# EAGLE design M891 (EAGLE 6.6.0)
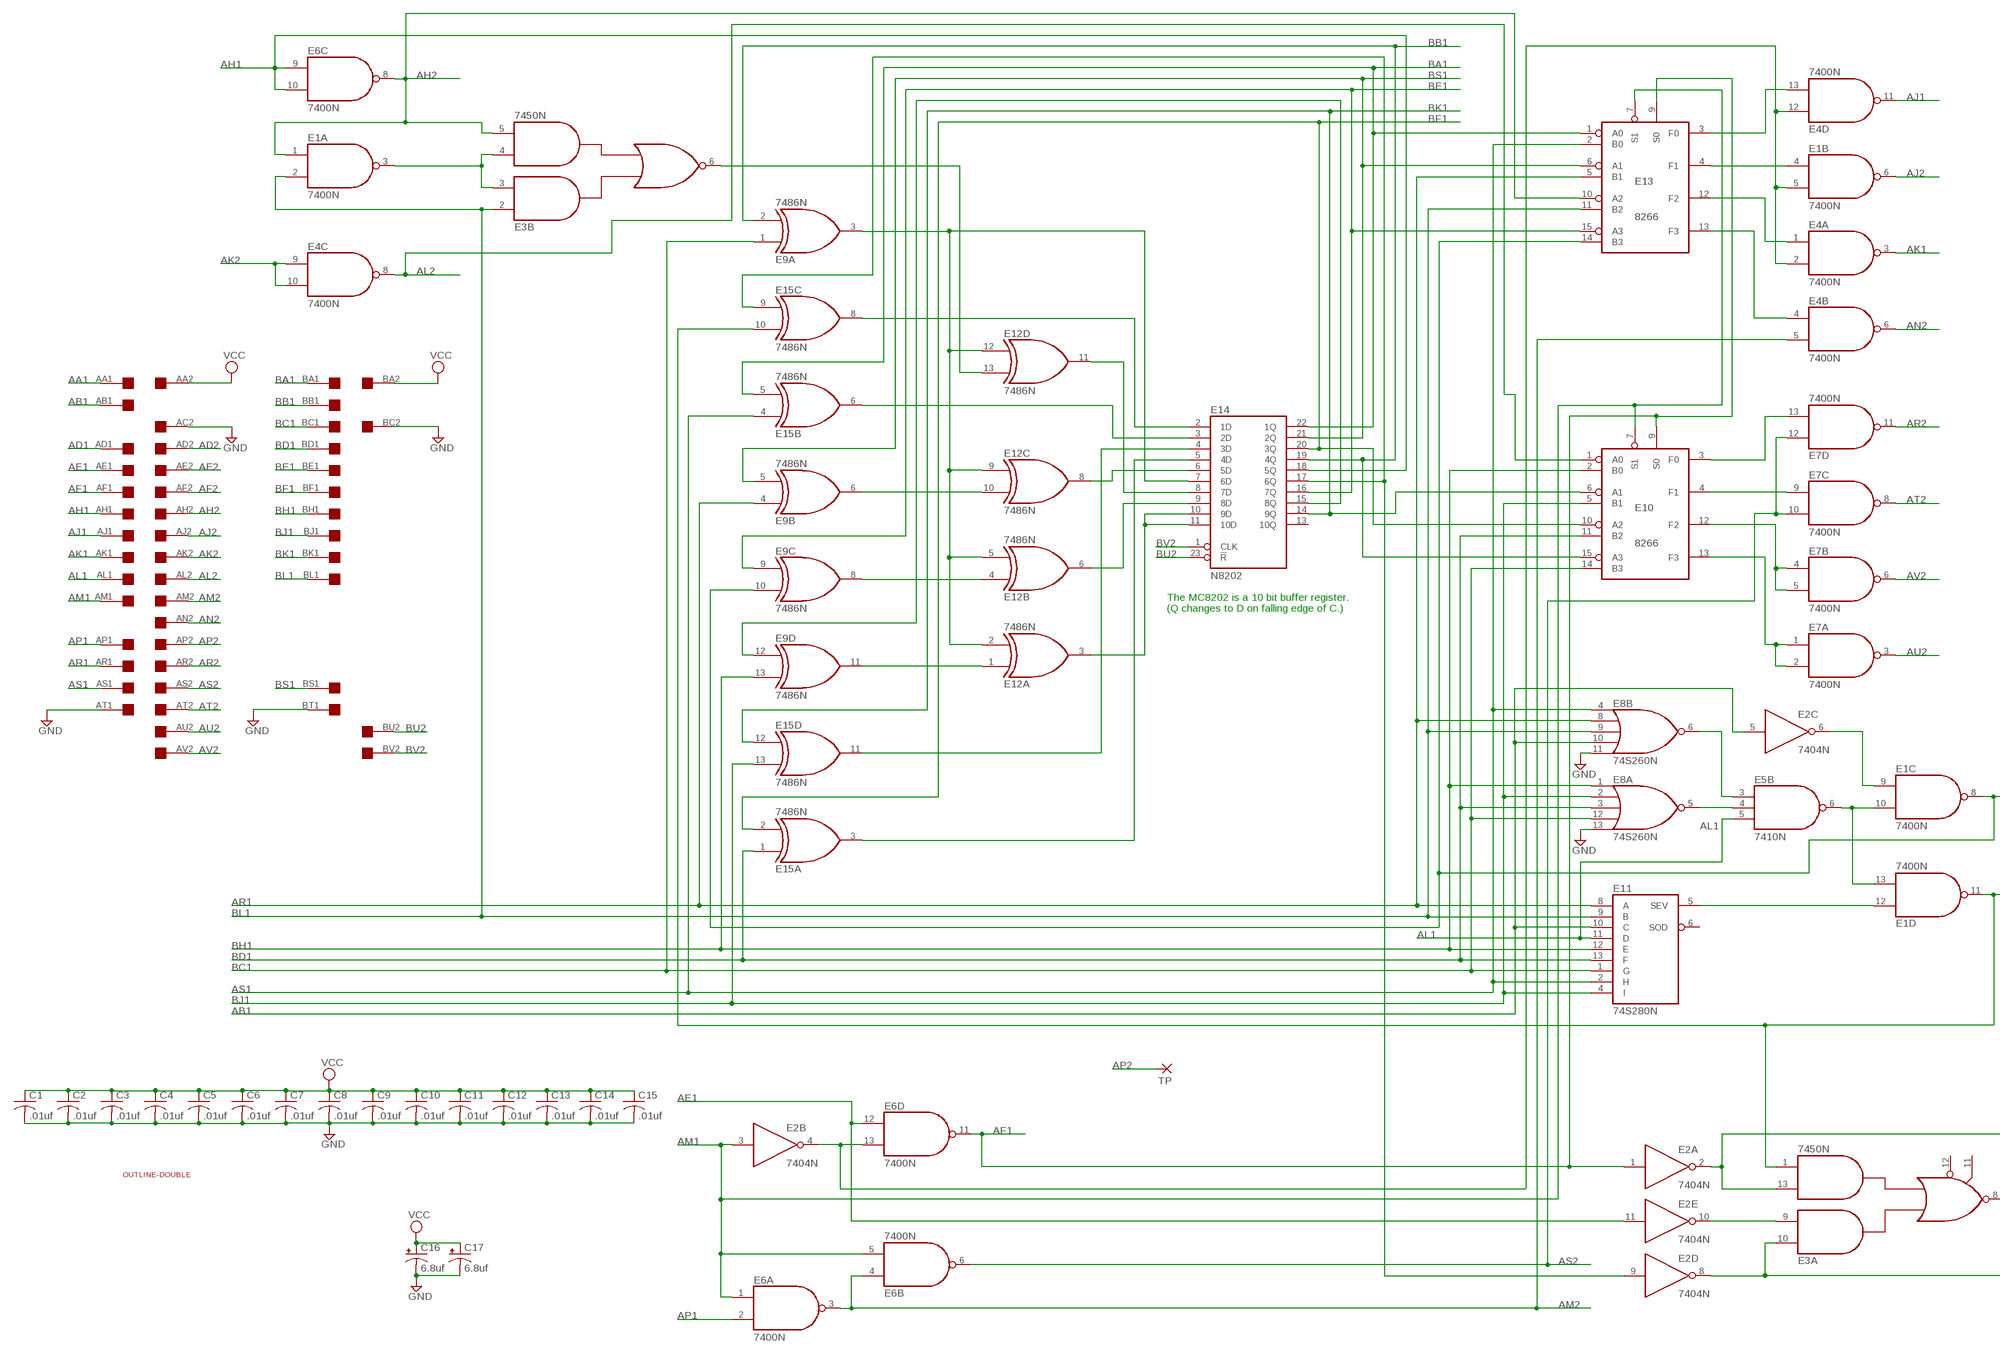
[diagram p0: schematic, sheet 1, part 1 of 2]
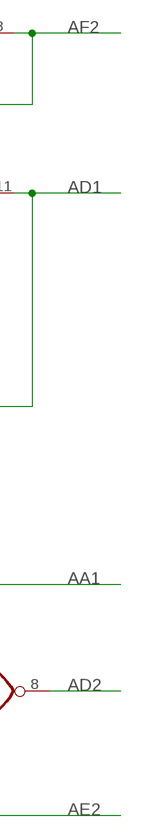
[diagram p1: schematic, sheet 1, part 2 of 2]

## Parts
C1  .01uf  C-US050-025X075  [C050-025X075]
C2  .01uf  C-US050-025X075  [C050-025X075]
C3  .01uf  C-US050-025X075  [C050-025X075]
C4  .01uf  C-US050-025X075  [C050-025X075]
C5  .01uf  C-US050-025X075  [C050-025X075]
C6  .01uf  C-US050-025X075  [C050-025X075]
C7  .01uf  C-US050-025X075  [C050-025X075]
C8  .01uf  C-US050-025X075  [C050-025X075]
C9  .01uf  C-US050-025X075  [C050-025X075]
C10  .01uf  C-US050-025X075  [C050-025X075]
C11  .01uf  C-US050-025X075  [C050-025X075]
C12  .01uf  C-US050-025X075  [C050-025X075]
C13  .01uf  C-US050-025X075  [C050-025X075]
C14  .01uf  C-US050-025X075  [C050-025X075]
C15  .01uf  C-US050-025X075  [C050-025X075]
C16  6.8uf  CPOL-USE22-6AXIAL  [E22-6]
C17  6.8uf  CPOL-USE22-6AXIAL  [E22-6]
E1  7400N  [DIL14]
E2  7404N  [DIL14]
E3  7450N  [DIL14]
E4  7400N  [DIL14]
E5  7410N  [DIL14]
E6  7400N  [DIL14]
E7  7400N  [DIL14]
E8  74S260N  [DIL14]
E9  7486N  [DIL14]
E10  8266  [DIL16]
E11  74S280N  [DIL14]
E12  7486N  [DIL14]
E13  8266  [DIL16]
E14  N8202  [DIL24]
E15  7486N  [DIL14]
EDGE  DOUBLE  [EDGE-CON4]
TP  2,15/1,0  [2,15/1,0]
U$2  OUTLINE-DOUBLE  [DOUBLE]

## Nets
AA1: E2.2(A:O) E3.13(A:I3) EDGE.AA1
AB1: E2.5(C:I) E8.10(B:I3) E11.10(C) EDGE.AB1
AD1: E1.11(D:O) E3.1(A:I4) E15.10(C:I1) EDGE.AD1
AD2: E3.8(A:O) EDGE.AD2
AE1: E2.11(E:I) E6.12(D:I0) EDGE.AE1
AE2: E2.8(D:O) E3.10(A:I1) EDGE.AE2
AF1: E2.1(A:I) E6.11(D:O) E10.9(S0) E13.9(S0) EDGE.AF1
AF2: E1.8(C:O) E9.10(C:I1) E13.14(B3) EDGE.AF2
AH1: E6.9(C:I0) E6.10(C:I1) E14.18(5Q) EDGE.AH1
AH2: E1.1(A:I0) E3.5(B:I4) E6.8(C:O) E13.10(A2) EDGE.AH2
AJ1: E4.11(D:O) EDGE.AJ1
AJ2: E1.6(B:O) EDGE.AJ2
AK1: E4.3(A:O) EDGE.AK1
AK2: E4.9(C:I0) E4.10(C:I1) EDGE.AK2
AL1: E5.5(B:I2) E11.11(D) EDGE.AL1
AL2: E4.8(C:O) E10.1(A0) EDGE.AL2
AM1: E2.3(B:I) E6.1(A:I0) E6.5(B:I1) E10.7(S1) E13.7(S1) EDGE.AM1
AM2: E4.5(B:I1) E6.3(A:O) E6.4(B:I0) EDGE.AM2
AN2: E4.6(B:O) EDGE.AN2
AP1: E6.2(A:I1) EDGE.AP1
AP2: EDGE.AP2 TP.1(P)
AR1: E8.8(B:I1) E9.4(B:I0) E11.8(A) E13.5(B1) EDGE.AR1
AR2: E7.11(D:O) EDGE.AR2
AS1: E8.4(B:I0) E11.2(H) E13.2(B0) E15.4(B:I0) EDGE.AS1
AS2: E6.6(B:O) E7.10(C:I1) E7.12(D:I0) EDGE.AS2
AT2: E7.8(C:O) EDGE.AT2
AU2: E7.3(A:O) EDGE.AU2
AV2: E7.6(B:O) EDGE.AV2
BA1: E13.1(A0) E14.22(1Q) E15.5(B:I1) EDGE.BA1
BB1: E9.2(A:I1) E10.15(A3) E14.19(4Q) EDGE.BB1
BC1: E8.12(A:I3) E9.1(A:I0) E10.14(B3) E11.1(G) EDGE.BC1
BD1: E8.3(A:I2) E10.11(B2) E11.13(F) E15.1(A:I0) EDGE.BD1
BE1: E9.9(C:I0) E13.15(A3) E14.16(7Q) EDGE.BE1
BF1: E10.10(A2) E14.20(3Q) E15.2(A:I1) EDGE.BF1
BH1: E8.1(A:I0) E9.13(D:I1) E10.2(B0) E11.12(E) EDGE.BH1
BJ1: E8.2(A:I1) E10.5(B1) E11.4(I) E15.13(D:I1) EDGE.BJ1
BK1: E10.6(A1) E14.14(9Q) E15.12(D:I0) EDGE.BK1
BL1: E1.2(A:I1) E3.2(B:I1) E8.9(B:I2) E11.9(B) E13.11(B2) EDGE.BL1
BS1: E9.5(B:I1) E13.6(A1) E14.21(2Q) EDGE.BS1
BU2: E14.23(!R) EDGE.BU2
BV2: E14.1(CLK) EDGE.BV2
GND [power]: C1.2 C2.2 C3.2 C4.2 C5.2 C6.2 C7.2 C8.2 C9.2 C10.2 C11.2 C12.2 C13.2 C14.2 C15.2 C16.- C17.- E8.11(B:I4) E8.13(A:I4) EDGE.AC2 EDGE.AT1 EDGE.BC2 EDGE.BT1
N$1: E1.3(A:O) E3.3(B:I2) E3.4(B:I3)
N$4: E2.9(D:I) E14.17(6Q) E15.9(C:I0)
N$5: E1.5(B:I1) E2.4(B:O) E4.2(A:I1) E4.12(D:I0) E6.13(D:I1)
N$6: E4.13(D:I1) E13.3(F0)
N$7: E1.4(B:I0) E13.4(F1)
N$8: E4.1(A:I0) E13.12(F2)
N$9: E4.4(B:I0) E13.13(F3)
N$10: E9.12(D:I0) E14.15(8Q)
N$11: E3.6(B:O) E12.13(D:I1)
N$12: E1.12(D:I0) E11.5(SEV)
N$13: E14.3(2D) E15.6(B:O)
N$14: E9.3(A:O) E12.2(A:I1) E12.5(B:I1) E12.9(C:I0) E12.12(D:I0) E14.7(6D)
N$15: E9.11(D:O) E12.1(A:I0)
N$16: E9.8(C:O) E12.4(B:I0)
N$17: E9.6(B:O) E12.10(C:I1)
N$18: E14.2(1D) E15.8(C:O)
N$19: E12.11(D:O) E14.8(7D)
N$20: E14.5(4D) E15.3(A:O)
N$21: E14.4(3D) E15.11(D:O)
N$22: E12.8(C:O) E14.6(5D)
N$23: E12.6(B:O) E14.9(8D)
N$24: E12.3(A:O) E14.10(9D) E14.11(10D)
N$25: E7.9(C:I0) E10.4(F1)
N$26: E7.13(D:I1) E10.3(F0)
N$27: E7.4(B:I0) E7.5(B:I1) E10.12(F2)
N$28: E7.1(A:I0) E7.2(A:I1) E10.13(F3)
N$33: E2.10(E:O) E3.9(A:I2)
N$43: E5.4(B:I1) E8.5(A:O)
N$44: E5.3(B:I0) E8.6(B:O)
N$45: E1.10(C:I1) E1.13(D:I1) E5.6(B:O)
N$46: E1.9(C:I0) E2.6(C:O)
VCC [power]: C1.1 C2.1 C3.1 C4.1 C5.1 C6.1 C7.1 C8.1 C9.1 C10.1 C11.1 C12.1 C13.1 C14.1 C15.1 C16.+ C17.+ EDGE.AA2 EDGE.BA2
Unconnected: E2.12(F:O) E2.13(F:I) E3.11(A:I6) E3.12(A:I5) E5.1(A:I0) E5.2(A:I1) E5.8(C:O) E5.9(C:I0) E5.10(C:I1) E5.11(C:I2) E5.12(A:O) E5.13(A:I2) E11.6(SOD) E14.13(10Q) EDGE.AB2 EDGE.AC1 EDGE.AN1 EDGE.AU1 EDGE.AV1 EDGE.BB2 EDGE.BD2 EDGE.BE2 EDGE.BF2 EDGE.BH2 EDGE.BJ2 EDGE.BK2 EDGE.BL2 EDGE.BM1 EDGE.BM2 EDGE.BN1 EDGE.BN2 EDGE.BP1 EDGE.BP2 EDGE.BR1 EDGE.BR2 EDGE.BS2 EDGE.BT2 EDGE.BU1 EDGE.BV1

## Notes on the sheet
- The MC8202 is a 10 bit buffer register.
- (Q changes to D on falling edge of C.)

## Power pins joined to a net without a drawn wire
GND: E1.7(P:GND) E2.7(P:GND) E3.7(P:GND) E4.7(P:GND) E5.7(P:GND) E6.7(P:GND) E7.7(P:GND) E8.7(P:GND) E9.7(P:GND) E10.8(GND) E11.7(GND) E12.7(P:GND) E13.8(GND) E14.12(GND) E15.7(P:GND)
VCC: E1.14(P:VCC) E2.14(P:VCC) E3.14(P:VCC) E4.14(P:VCC) E5.14(P:VCC) E6.14(P:VCC) E7.14(P:VCC) E8.14(P:VCC) E9.14(P:VCC) E10.16(VCC) E11.14(VCC) E12.14(P:VCC) E13.16(VCC) E14.24(VCC) E15.14(P:VCC)

## Library data of the parts
C1-C15 = rcl:C-US: CAPACITOR, American symbol
C16 C17 = rcl:CPOL-US: POLARIZED CAPACITOR, American symbol
E1 E4 E6 E7 = 74xx-us:74*00: Quad 2-input NAND gate
E2 = 74xx-us:74*04: Hex INVERTER
E3 = dec-con:74*50: 4-2-3-2 input AND OR INVERTER gates
E5 = 74xx-us:74*10: Triple 3-input NAND gate
E8 = 74xx-us:74*260: Dual 5-input positive NOR gate
E9 E12 E15 = 74xx-us:74*86: Quad 2-input EXCLUSIV-OR (XOR) gate
E10 E13 = dec-con:8266: Quad 2-1 selector
E11 = 74xx-us:74*280: 9-bit odd/even PARITY GENERATOR/CHECKER
E14 = dec-con:N8202: 10 bit register
EDGE = dec-con:DOUBLE: Double-Height DEC board
TP = wirepad:2,15/1,0: THROUGH-HOLE PAD
U$2 = dec-con:OUTLINE-*: Board outlines for DEC boards.

## Net classes
1 power: width 0.508 mm

## Board
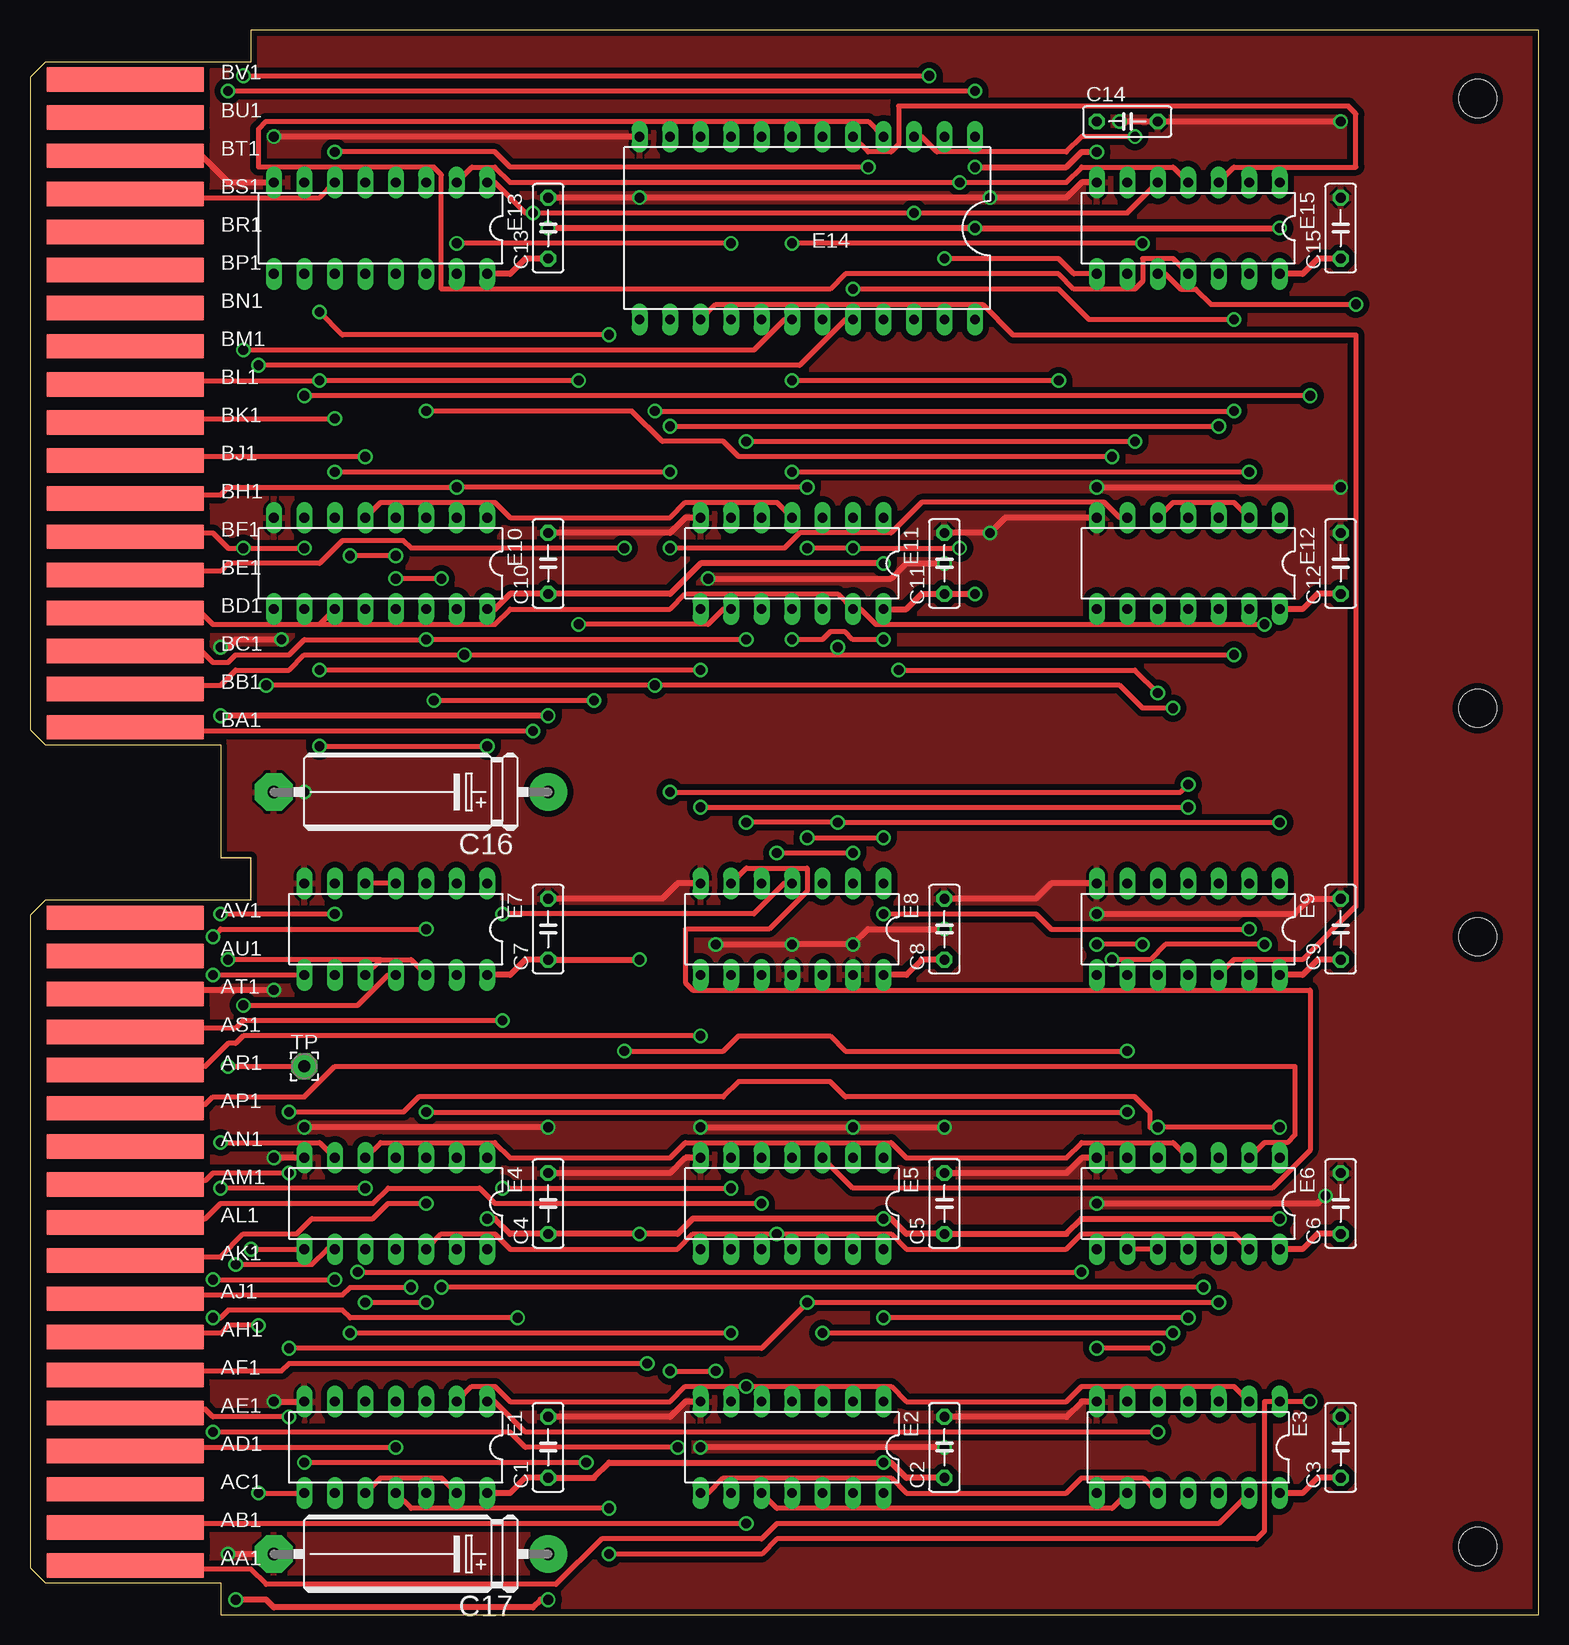
[diagram p2: board, top side]
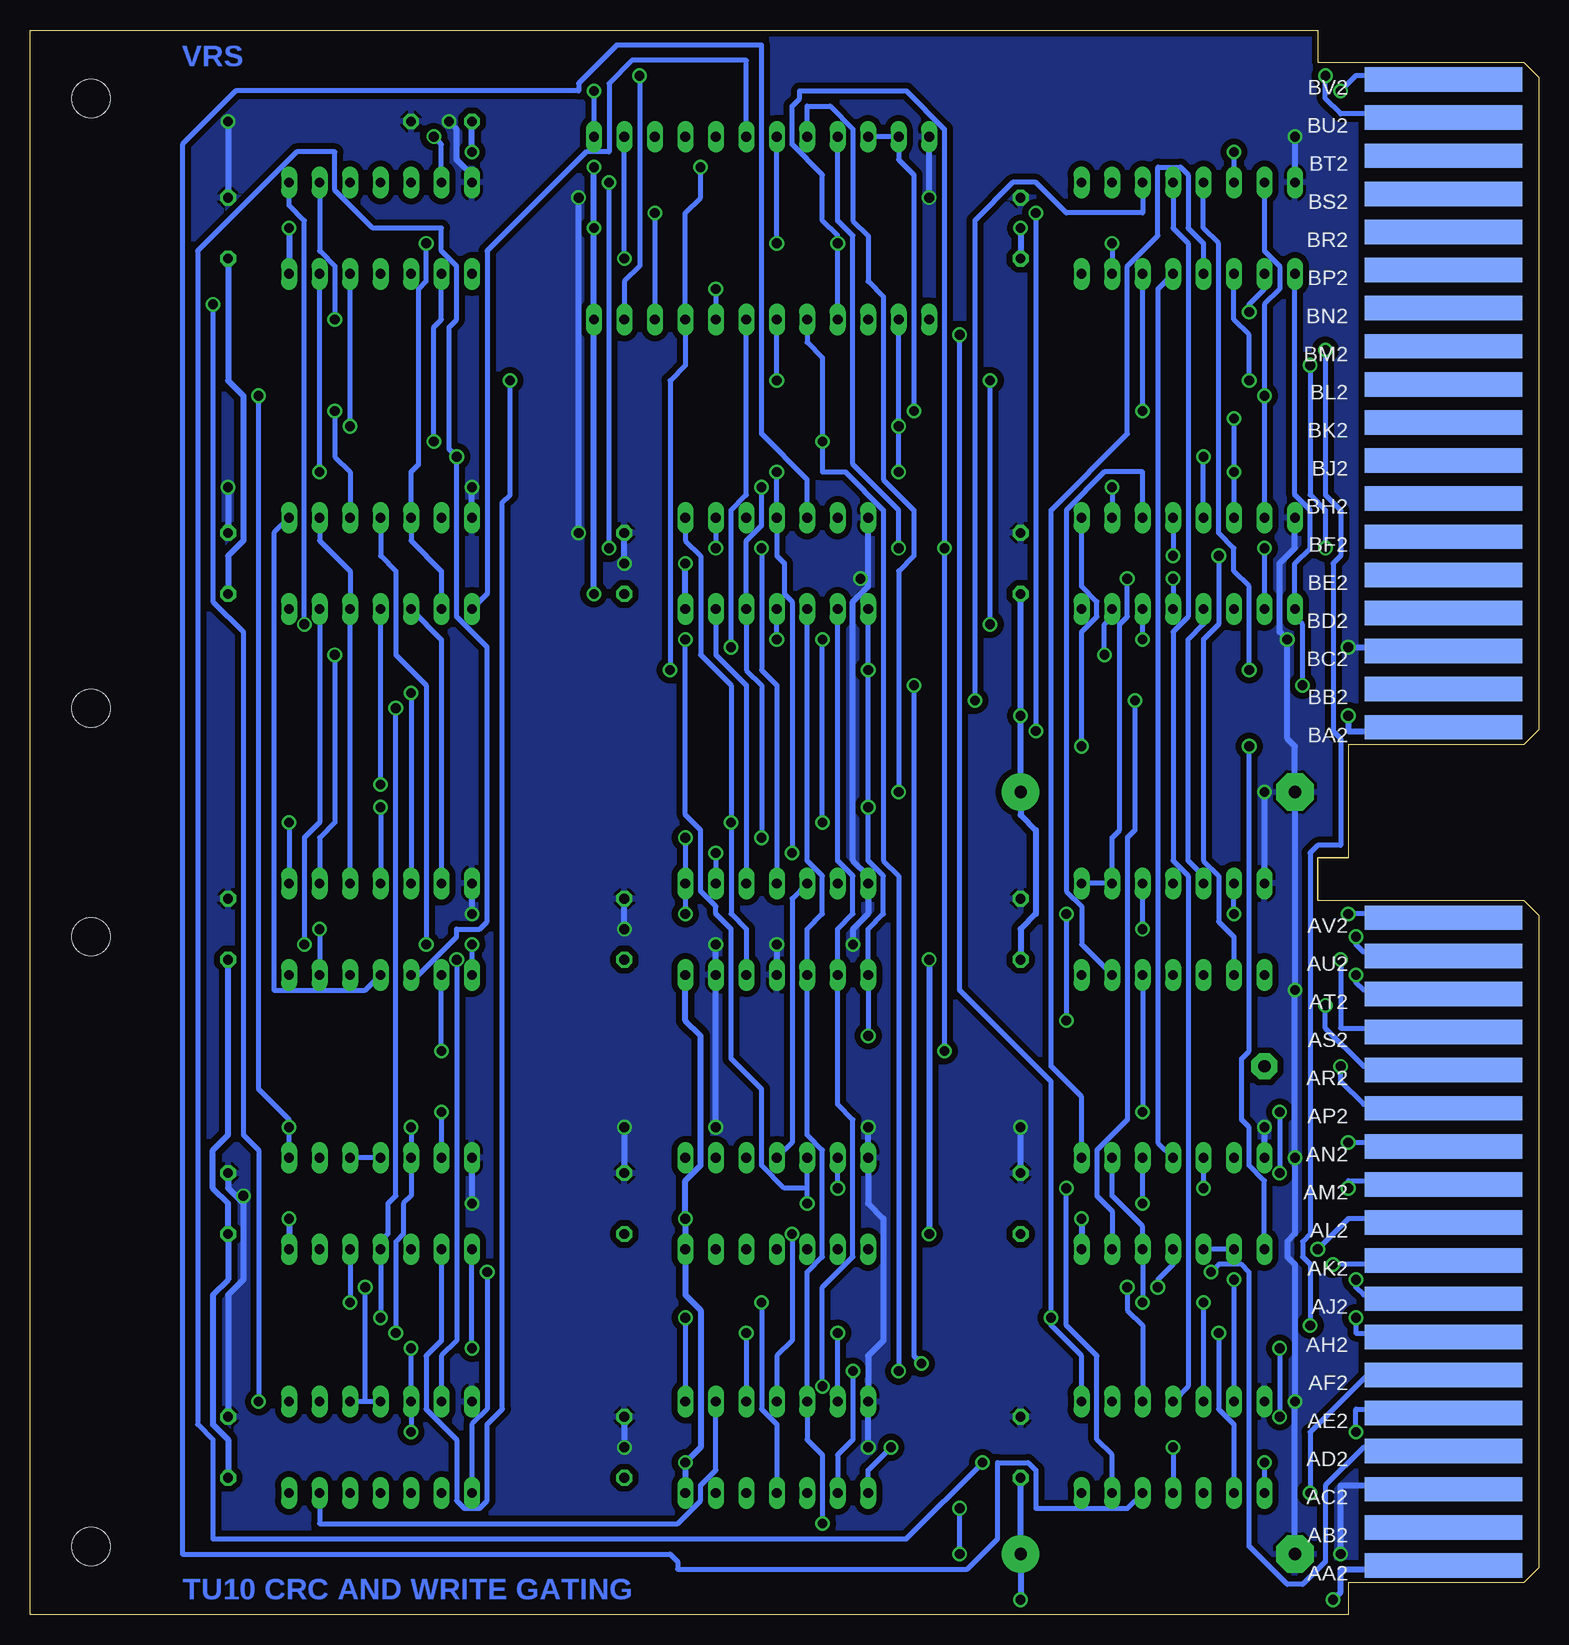
[diagram p3: board, bottom side, seen from below]

Size 125.73 x 132.08 mm. Coordinates in mm from the lower left corner, seen from the top.
Copper layers (1+16): Top 0.035mm / dielectric 1.5mm / Bottom 0.035mm
Design rules "16mils": minimum track width 16mil, minimum drill 32mil, track to track 15mil, track to pad 10mil, pad to pad 10mil, via to via 10mil, smd to smd 10mil, copper to edge 13mil, drill to drill 10mil, minimum pad ring 10mil, minimum via ring 8mil, stop-mask expansion 0mil, vias tented up to drill 0mil, thermal gap 10mil

### Footprints (pad centres in the part's own frame; a part is rotated, then mirrored left to right if it is on the bottom)
C050-025X075 = drill 0.813 octagon: 1 -2.54,0; 2 2.54,0
E22-6 = drill 1.016 pad 3.15: + -11.43,0 | drill 1.016 pad 3.15 octagon: - 11.43,0
DIL14 = drill 0.813 long: 1 -7.62,-3.81; 2 -5.08,-3.81; 3 -2.54,-3.81; 4 0,-3.81; 5 2.54,-3.81; 6 5.08,-3.81; 7 7.62,-3.81; 8 7.62,3.81; 9 5.08,3.81; 10 2.54,3.81; 11 0,3.81; 12 -2.54,3.81; 13 -5.08,3.81; 14 -7.62,3.81
DIL16 = drill 0.813 long: 1 -8.89,-3.81; 2 -6.35,-3.81; 3 -3.81,-3.81; 4 -1.27,-3.81; 5 1.27,-3.81; 6 3.81,-3.81; 7 6.35,-3.81; 8 8.89,-3.81; 9 8.89,3.81; 10 6.35,3.81; 11 3.81,3.81; 12 1.27,3.81; 13 -1.27,3.81; 14 -3.81,3.81; 15 -6.35,3.81; 16 -8.89,3.81
DIL24 = drill 0.813 long: 1 -12.7,-7.62; 2 -10.16,-7.62; 3 -7.62,-7.62; 4 -5.08,-7.62; 5 -2.54,-7.62; 6 0,-7.62; 7 2.54,-7.62; 8 5.08,-7.62; 9 7.62,-7.62; 10 10.16,-7.62; 11 12.7,-7.62; 12 15.24,-7.62; 13 15.24,7.62; 14 12.7,7.62; 15 10.16,7.62; 16 7.62,7.62; 17 5.08,7.62; 18 2.54,7.62; 19 0,7.62; 20 -2.54,7.62; 21 -5.08,7.62; 22 -7.62,7.62; 23 -10.16,7.62; 24 -12.7,7.62
EDGE-CON4 = smd 13.106 x 2.032: AA1 7.938,4.128; AB1 7.938,7.303; AC1 7.938,10.477; AD1 7.938,13.652; AE1 7.938,16.828; AF1 7.938,20.003; AH1 7.938,23.177; AJ1 7.938,26.352; AK1 7.938,29.527; AL1 7.938,32.703; AM1 7.938,35.877; AN1 7.938,39.053; AP1 7.938,42.227; AR1 7.938,45.403; AS1 7.938,48.578; AT1 7.938,51.752; AU1 7.938,54.928; AV1 7.938,58.102; BA1 7.938,73.978; BB1 7.938,77.153; BC1 7.938,80.328; BD1 7.938,83.502; BE1 7.938,86.677; BF1 7.938,89.853; BH1 7.938,93.028; BJ1 7.938,96.203; BK1 7.938,99.377; BL1 7.938,102.552; BM1 7.938,105.728; BN1 7.938,108.903; BP1 7.938,112.078; BR1 7.938,115.252; BS1 7.938,118.427; BT1 7.938,121.603; BU1 7.938,124.778; BV1 7.938,127.953 | smd 13.106 x 2.032 bottom: AA2 7.938,4.128; AB2 7.938,7.303; AC2 7.938,10.477; AD2 7.938,13.652; AE2 7.938,16.828; AF2 7.938,20.003; AH2 7.938,23.177; AJ2 7.938,26.352; AK2 7.938,29.527; AL2 7.938,32.703; AM2 7.938,35.877; AN2 7.938,39.053; AP2 7.938,42.227; AR2 7.938,45.403; AS2 7.938,48.578; AT2 7.938,51.752; AU2 7.938,54.928; AV2 7.938,58.102; BA2 7.938,73.978; BB2 7.938,77.153; BC2 7.938,80.328; BD2 7.938,83.502; BE2 7.938,86.677; BF2 7.938,89.853; BH2 7.938,93.028; BJ2 7.938,96.203; BK2 7.938,99.377; BL2 7.938,102.552; BM2 7.938,105.728; BN2 7.938,108.903; BP2 7.938,112.078; BR2 7.938,115.252; BS2 7.938,118.427; BT2 7.938,121.603; BU2 7.938,124.778; BV2 7.938,127.953
2,15/1,0 = drill 1.016 pad 2.159 octagon: 1 0,0
DOUBLE = hole 3.175: 120.65,56.515; 120.65,5.715; 120.65,75.565; 120.65,126.365

### Placement (x,y rotation side)
C1  43.18,13.97 90 top
C2  76.2,13.97 90 top
C3  109.22,13.97 90 top
C4  43.18,34.29 90 top
C5  76.2,34.29 90 top
C6  109.22,34.29 90 top
C7  43.18,57.15 90 top
C8  76.2,57.15 90 top
C9  109.22,57.15 90 top
C10  43.18,87.63 90 top
C11  76.2,87.63 90 top
C12  109.22,87.63 90 top
C13  43.18,115.57 90 top
C14  91.44,124.46 0 top
C15  109.22,115.57 90 top
C16  31.75,68.58 180 top
C17  31.75,5.08 180 top
E1  30.48,13.97 180 top
E2  63.5,13.97 180 top
E3  96.52,13.97 180 top
E4  30.48,34.29 180 top
E5  63.5,34.29 180 top
E6  96.52,34.29 180 top
E7  30.48,57.15 180 top
E8  63.5,57.15 180 top
E9  96.52,57.15 180 top
E10  29.21,87.63 180 top
E11  63.5,87.63 180 top
E12  96.52,87.63 180 top
E13  29.21,115.57 180 top
E14  66.04,115.57 180 top
E15  96.52,115.57 180 top
EDGE  0,0 0 top
TP  22.86,45.72 0 top
U$2  0,0 0 top

### Tracks (layer width: path | path; a pad name or v marks a point on that pad's centre or on a via)
AA1
  Top 0.406: E3.13 99.06,7.62 62.23,7.62 60.96,6.35 47.63,6.35 43.82,2.54 19.69,2.54 18.42,3.81 8.26,3.81 EDGE.AA1
  Bottom 0.406: E2.2 68.58,12.06 69.85,10.79 69.85,9.53 71.76,7.62 101.6,7.62 E3.13
AB1  (via drill 0.81)
  Top 0.406: v59.69,7.62 8.26,7.62 EDGE.AB1
  Bottom 0.406: E11.10 60.96,62.87 59.69,61.59 59.69,58.42 60.96,57.15 E8.10 60.96,40.01 59.69,38.73 59.69,29.84 60.96,28.57 E2.5 60.96,14.61 59.69,13.34 v59.69,7.62
AD1  (via drill 0.81)
  Top 0.406: v30.48,13.97 8.26,13.97 EDGE.AD1 | v106.68,17.78 E3.1 102.87,17.78 102.87,6.99 102.24,6.35 62.23,6.35 60.96,5.08 v48.26,5.08 | v110.49,109.22 98.43,109.22 97.16,110.49 95.89,110.49 94.62,111.76 E15.10 | E1.11 31.75,8.89 v48.26,8.89
  Bottom 0.406: v30.48,13.97 E1.11 | v106.68,17.78 106.68,38.73 107.95,40.01 107.95,81.92 110.49,84.45 v110.49,109.22 | v48.26,5.08 v48.26,8.89
AD2  (via drill 0.81)
  Top 0.406: v27.31,28.57 v87.63,28.57
  Bottom 0.406: E3.8 88.9,15.88 87.63,17.14 v87.63,28.57 | v27.31,28.57 26.67,29.21 24.77,29.21 24.13,28.57 24.13,5.71 20.96,2.54 19.69,2.54 17.78,4.45 17.78,10.79 14.61,13.97 8.26,13.97 EDGE.AD2
AE1  (via drill 0.81)
  Top 0.406: v99.06,26.04 v64.77,26.04 60.96,22.23 v21.59,22.23 | v21.59,16.51 15.24,16.51 14.61,17.14 8.26,17.14 EDGE.AE1
  Bottom 0.406: E2.11 63.5,15.88 64.77,17.14 v64.77,26.04 | E6.12 v99.06,26.04 | v21.59,22.23 v21.59,16.51
AE2  (via drill 0.81)
  Top 0.406: E3.10 92.71,11.43 87.63,11.43 86.36,10.16 73.03,10.16 71.76,11.43 57.79,11.43 56.52,10.16 E2.8 | v15.24,15.24 40.01,15.24 41.28,13.97 v53.98,13.97
  Bottom 0.406: v15.24,15.24 15.24,17.14 8.26,17.14 EDGE.AE2 | v53.98,13.97 55.88,12.06 E2.8
AF1  (via drill 0.81)
  Top 0.406: v96.52,24.77 v71.12,24.77 | v19.69,77.47 v52.07,77.47 90.81,77.47 92.71,75.56 v95.25,75.56 | v51.44,20.95 21.59,20.95 20.96,20.32 8.26,20.32 EDGE.AF1
  Bottom 0.406: E13.9 20.32,93.34 19.05,92.08 19.05,88.9 20.32,87.63 E10.9 20.32,83.19 19.69,82.55 v19.69,77.47 | v71.12,24.77 E2.1 | v96.52,24.77 E6.11 96.52,31.11 95.89,31.75 95.89,34.29 95.25,34.92 v95.25,75.56 | v51.44,20.95 52.07,21.59 v52.07,77.47
AF2  (via drill 0.81)
  Top 0.406: v19.05,10.16 E1.8 | v33.02,100.33 50.17,100.33 52.71,97.79 57.79,97.79 59.06,96.52 v90.17,96.52 | v46.36,12.7 v22.86,12.7
  Bottom 0.406: v19.05,10.16 19.05,15.24 13.97,20.32 8.26,20.32 EDGE.AF2 | v33.02,100.33 E13.14 | E9.10 93.35,53.34 90.17,56.52 90.17,57.15 88.27,57.15 87.63,57.78 87.63,80.64 90.17,83.19 v90.17,96.52 90.81,97.16 90.81,107.31 90.17,107.95 90.17,112.39 91.44,113.67 91.44,115.57 97.16,115.57 100.33,118.75 100.33,121.92 103.51,121.92 111.76,113.67 111.76,15.88 110.49,14.61 110.49,6.35 52.71,6.35 v46.36,12.7 | v22.86,12.7 E1.8
AH1  (via drill 0.81)
  Top 0.406: E6.10 E6.9 | v85.73,102.87 v63.5,102.87 | v19.05,24.13 16.51,24.13 15.88,23.5 8.26,23.5 EDGE.AH1 | v17.78,105.41 60.33,105.41 62.87,107.95 E14.18
  Bottom 0.406: v63.5,102.87 E14.18 | v85.73,102.87 85.73,93.34 86.36,92.71 86.36,17.14 87.63,15.88 87.63,9.53 88.27,8.89 89.54,8.89 90.17,9.53 90.17,14.61 92.71,17.14 92.71,21.59 91.44,22.86 E6.9 | v19.05,24.13 19.05,29.21 19.69,29.84 19.69,31.11 19.05,31.75 19.05,63.5 18.42,64.14 16.51,64.14 16.51,73.03 17.15,73.66 17.15,87.63 16.51,88.27 16.51,92.08 17.78,93.34 v17.78,105.41
AH2  (via drill 0.81)
  Top 0.406: E1.1 38.74,17.78 41.28,15.24 v93.98,15.24 | v93.98,22.23 v88.9,22.23 | v24.13,108.58 26.04,106.68 v48.26,106.68 | v15.24,24.77 15.88,24.77 16.51,25.4 26.04,25.4 26.67,24.77 v40.64,24.77
  Bottom 0.406: v93.98,15.24 E3.5 v93.98,22.23 | v88.9,22.23 E6.8 | E13.10 22.86,110.49 24.13,109.22 v24.13,108.58 | v48.26,106.68 48.26,52.07 40.64,44.45 v40.64,24.77 40.64,24.13 38.1,21.59 E1.1 | v15.24,24.77 15.24,23.5 8.26,23.5 EDGE.AH2
AJ1  (via drill 0.81)
  Top 0.406: v31.75,27.3 26.67,27.3 26.04,26.67 8.26,26.67 EDGE.AJ1
  Bottom 0.406: E4.11 30.48,29.21 31.75,27.94 v31.75,27.3
AJ2  (via drill 0.81)
  Top 0.406: v15.24,27.94 v25.4,27.94
  Bottom 0.406: v25.4,27.94 E1.6 | v15.24,27.94 15.24,27.3 14.61,26.67 8.26,26.67 EDGE.AJ2
AK1  (via drill 0.81)
  Top 0.406: v33.02,34.29 29.85,34.29 28.58,33.02 23.5,33.02 22.23,31.75 17.78,31.75 15.88,29.84 8.26,29.84 EDGE.AK1
  Bottom 0.406: v33.02,34.29 E4.3
AK2  (via drill 0.81)
  Top 0.406: E4.9 24.77,30.48 23.5,29.21 v17.15,29.21
  Bottom 0.406: E4.9 E4.10 | v17.15,29.21 12.07,29.21 11.43,29.84 8.26,29.84 EDGE.AK2
AL1  (via drill 0.81)
  Top 0.406: v60.96,34.29 38.74,34.29 37.47,35.56 29.85,35.56 28.58,34.29 15.88,34.29 14.61,33.02 8.26,33.02 EDGE.AL1 | v63.5,81.28 66.04,81.28 66.68,81.92 67.95,81.92 68.58,81.28 v71.12,81.28
  Bottom 0.406: v60.96,34.29 60.96,35.56 | 60.96,35.56 E5.5 | v63.5,81.28 E11.11 | v71.12,81.28 71.12,66.67 69.85,65.41 69.85,60.33 68.58,59.05 68.58,58.42 67.31,57.15 67.31,46.35 64.77,43.81 64.77,37.47 62.87,35.56 60.96,35.56
AL2  (via drill 0.81)
  Top 0.406: v18.42,30.48 E4.8 | v24.13,72.39 v38.1,72.39
  Bottom 0.406: v18.42,30.48 15.88,33.02 8.26,33.02 EDGE.AL2 | E10.1 38.1,85.72 36.83,84.45 36.83,83.19 38.1,81.92 v38.1,72.39 | v24.13,72.39 24.13,46.99 24.77,46.35 24.77,41.27 24.13,40.64 24.13,37.47 22.86,36.2 E4.8
AM1  (via drill 0.81)
  Top 0.406: v104.14,40.64 v93.98,40.64 93.35,40.64 93.35,41.91 92.08,43.18 67.95,43.18 66.68,44.45 59.06,44.45 57.79,43.18 32.39,43.18 31.12,41.91 v21.59,41.91 | v95.25,23.5 v66.04,23.5 | v106.68,101.6 v22.86,101.6 | v21.59,36.83 15.24,36.83 14.61,36.2 8.26,36.2 EDGE.AM1
  Bottom 0.406: E10.7 v22.86,101.6 22.86,109.22 21.59,110.49 21.59,112.39 22.86,113.67 E13.7 | v93.98,40.64 E6.5 93.98,34.92 94.62,34.29 94.62,31.75 95.25,31.11 v95.25,23.5 | E6.1 v104.14,40.64 104.14,41.27 106.68,43.81 v106.68,101.6 | v66.04,23.5 E2.3 | v21.59,41.91 v21.59,36.83
AM2  (via drill 0.81)
  Top 0.406: E6.4 95.25,39.37 87.63,39.37 86.36,38.1 73.03,38.1 71.76,39.37 54.61,39.37 53.34,38.1 40.01,38.1 38.74,39.37 29.21,39.37 E4.5 | v27.94,35.56 v15.88,35.56
  Bottom 0.406: E6.4 E6.3 | v15.88,35.56 15.88,36.2 8.26,36.2 EDGE.AM2 | E4.5 v27.94,35.56
AN2  (via drill 0.81)
  Top 0.406: E4.6 24.13,39.37 v15.88,39.37
  Bottom 0.406: v15.88,39.37 8.26,39.37 EDGE.AN2
AP1
  Top 0.406: E6.2 102.87,39.37 104.78,39.37 105.41,40.01 105.41,45.72 25.4,45.72 22.86,43.18 15.24,43.18 14.61,42.55 8.26,42.55 EDGE.AP1
AP2  (via drill 0.81)
  Top 0.406: v16.51,45.72 TP.1
  Bottom 0.406: v16.51,45.72 16.51,44.45 14.61,42.55 8.26,42.55 EDGE.AP2
AR1  (via drill 0.81)
  Top 0.406: v55.88,78.74 v24.13,78.74 | v55.88,67.31 v96.52,67.31 | v55.88,48.26 17.78,48.26 17.15,47.62 16.51,47.62 14.61,45.72 8.26,45.72 EDGE.AR1
  Bottom 0.406: E11.8 v55.88,78.74 v55.88,67.31 55.88,62.87 54.61,61.59 54.61,58.42 55.88,57.15 E8.8 v55.88,48.26 | E13.5 27.94,115.57 26.67,114.3 26.67,90.17 25.4,88.9 25.4,87 24.13,85.72 v24.13,78.74 | v96.52,67.31 E9.4
AR2  (via drill 0.81)
  Top 0.406: E7.11 29.85,53.34 27.31,50.8 v17.78,50.8
  Bottom 0.406: v17.78,50.8 17.78,48.9 14.61,45.72 8.26,45.72 EDGE.AR2
AS1  (via drill 0.81)
  Top 0.406: E15.4 95.25,120.65 87.63,120.65 86.36,119.38 v77.47,119.38 40.01,119.38 38.74,120.65 36.83,120.65 E13.2 | v64.77,88.9 v68.58,88.9 v77.47,88.9 | v39.37,49.53 17.78,49.53 17.15,48.9 8.26,48.9 EDGE.AS1 | v39.37,58.42 60.33,58.42 62.87,60.96 E8.4
  Bottom 0.406: E8.4 63.5,77.47 64.77,78.74 v64.77,88.9 | E11.2 v68.58,88.9 | v39.37,58.42 v39.37,49.53 | v77.47,88.9 v77.47,119.38
AS2  (via drill 0.81)
  Top 0.406: E7.12 31.75,54.61 29.21,54.61 | E7.10 29.21,54.61 | v33.02,41.91 v91.44,41.91 | 29.21,54.61 v16.51,54.61
  Bottom 0.406: v91.44,41.91 E6.6 | E7.12 v33.02,41.91 | v16.51,54.61 16.51,48.9 8.26,48.9 EDGE.AS2
AT2  (via drill 0.81)
  Top 0.406: v15.24,53.34 E7.8
  Bottom 0.406: v15.24,53.34 15.24,52.7 14.61,52.07 8.26,52.07 EDGE.AT2
AU2  (via drill 0.81)
  Top 0.406: v33.02,57.15 15.88,57.15 v15.24,56.52
  Bottom 0.406: v33.02,57.15 E7.3 | v15.24,56.52 15.24,55.88 14.61,55.24 8.26,55.24 EDGE.AU2
AV2  (via drill 0.81)
  Top 0.406: v15.88,58.42 v25.4,58.42
  Bottom 0.406: v25.4,58.42 E7.6 | v15.88,58.42 8.26,58.42 EDGE.AV2
BA1  (via drill 0.81)
  Top 0.406: E15.5 91.44,116.84 v73.66,116.84 v41.91,116.84 41.28,116.84 38.74,119.38 E13.1 | v41.91,73.66 8.26,73.66 EDGE.BA1
  Bottom 0.406: v73.66,116.84 E14.22 | v41.91,116.84 v41.91,73.66
BB1  (via drill 0.81)
  Top 0.406: EDGE.BB1 8.26,77.47 15.88,77.47 17.15,78.74 21.59,78.74 22.86,80.01 v36.2,80.01 67.31,80.01 | 67.31,80.01 v100.33,80.01 | 67.31,80.01 v67.31,80.64
  Bottom 0.406: E10.15 35.56,83.19 36.2,82.55 v36.2,80.01 | E9.2 101.6,64.77 100.33,66.04 v100.33,80.01 | E14.19 66.04,93.34 67.31,92.08 v67.31,80.64
BC1  (via drill 0.81)
  Top 0.406: EDGE.BC1 8.26,80.64 13.97,80.64 15.24,79.38 16.51,79.38 17.15,80.01 21.59,80.01 22.86,81.28 v33.02,81.28 v59.69,81.28 | v104.14,66.04 v67.31,66.04 v59.69,66.04
  Bottom 0.406: v33.02,81.28 E10.14 | E8.12 66.04,57.15 67.31,58.42 v67.31,66.04 67.31,77.47 69.85,80.01 69.85,88.27 71.12,89.53 E11.1 | v104.14,66.04 E9.1 | v59.69,66.04 v59.69,81.28
BD1  (via drill 0.81)
  Top 0.406: 24.13,82.55 E10.11 | 24.13,82.55 15.24,82.55 13.97,83.82 8.26,83.82 EDGE.BD1 | 24.13,82.55 38.74,82.55 40.01,83.82 53.34,83.82 54.61,85.09 67.31,85.09 E11.13 69.22,83.82 70.49,82.55 v102.87,82.55
  Bottom 0.406: E8.3 66.04,77.47 68.58,80.01 E11.13 | E15.1 104.14,117.47 102.87,116.2 v102.87,82.55
BE1  (via drill 0.81)
  Top 0.406: v58.42,114.3 v35.56,114.3 | v91.44,46.99 67.95,46.99 66.68,48.26 59.06,48.26 57.79,46.99 v49.53,46.99 | v49.53,88.9 31.75,88.9 31.12,89.53 26.04,89.53 24.13,87.63 16.51,87.63 15.88,87 8.26,87 EDGE.BE1
  Bottom 0.406: v35.56,114.3 E13.15 | E14.16 v58.42,114.3 58.42,114.94 59.69,116.2 59.69,120.02 62.23,122.56 62.23,125.73 61.6,126.36 61.6,127 52.71,127 49.53,123.83 v49.53,88.9 v49.53,46.99 | v91.44,46.99 E9.9
BF1  (via drill 0.81)
  Top 0.406: v22.86,88.9 v17.78,88.9 16.51,88.9 15.24,90.17 8.26,90.17 EDGE.BF1 | v68.58,110.49 85.73,110.49 88.27,107.95 v100.33,107.95 | v19.05,104.14 64.14,104.14 67.95,107.95 E14.20
  Bottom 0.406: v22.86,88.9 E10.10 | v68.58,110.49 E14.20 | v100.33,107.95 100.33,112.39 101.6,113.67 E15.2 | v17.78,88.9 17.78,92.08 19.05,93.34 v19.05,104.14
BH1  (via drill 0.81)
  Top 0.406: EDGE.BH1 8.26,93.34 15.88,93.34 16.51,93.98 v35.56,93.98 v64.77,93.98 | v64.77,64.77 v71.12,64.77 | v101.6,57.15 85.09,57.15 83.82,58.42 v71.12,58.42
  Bottom 0.406: v35.56,93.98 E10.2 | v71.12,64.77 E8.1 v71.12,58.42 | v64.77,64.77 64.77,77.47 66.04,78.74 E11.12 66.04,89.53 64.77,90.81 v64.77,93.98 | v101.6,57.15 E9.13
BJ1  (via drill 0.81)
  Top 0.406: E11.4 62.23,92.71 54.61,92.71 53.34,91.44 40.01,91.44 38.74,92.71 29.21,92.71 E10.5 | v62.23,63.5 v68.58,63.5 | v63.5,95.25 v101.6,95.25 | v27.94,96.52 8.26,96.52 EDGE.BJ1
  Bottom 0.406: v68.58,63.5 E8.2 | v62.23,63.5 62.23,84.45 62.87,85.09 62.87,87.63 63.5,88.27 E11.4 v63.5,95.25 | v101.6,95.25 E15.13 | E10.5 v27.94,96.52
BK1  (via drill 0.81)
  Top 0.406: v25.4,99.69 8.26,99.69 EDGE.BK1 | v25.4,95.25 v53.34,95.25 | v53.34,99.06 v99.06,99.06
  Bottom 0.406: v25.4,99.69 v25.4,95.25 E10.6 | v53.34,95.25 v53.34,99.06 E14.14 | v99.06,99.06 E15.12
BL1  (via drill 0.81)
  Top 0.406: EDGE.BL1 8.26,102.87 v24.13,102.87 v45.72,102.87 | E3.2 100.33,19.05 87.63,19.05 86.36,17.78 73.03,17.78 71.76,19.05 v59.69,19.05 54.61,19.05 53.34,17.78 40.01,17.78 38.74,19.05 36.83,19.05 E1.2 | v45.72,82.55 56.52,82.55 57.79,83.82 E11.9
  Bottom 0.406: E13.11 25.4,107.95 24.13,106.68 v24.13,102.87 | E11.9 58.42,62.87 57.15,61.59 57.15,58.42 58.42,57.15 E8.9 58.42,42.55 57.15,41.27 57.15,29.84 59.69,27.3 v59.69,19.05 | v45.72,82.55 v45.72,102.87
BS1  (via drill 0.81)
  Top 0.406: E13.6 24.13,118.11 12.07,118.11 11.43,118.75 8.26,118.75 EDGE.BS1 | v93.98,76.83 92.08,78.74 v72.39,78.74 | v25.4,121.92 38.74,121.92 40.01,120.65 v69.85,120.65
  Bottom 0.406: v93.98,76.83 E9.5 | v72.39,78.74 72.39,102.87 71.12,104.14 E14.21 71.12,116.84 69.85,118.11 v69.85,120.65 | v25.4,121.92 E13.6
BU2  (via drill 0.81)
  Top 0.406: v17.78,128.27 v74.93,128.27
  Bottom 0.406: E14.23 76.2,111.12 74.93,112.39 v74.93,128.27 | v17.78,128.27 17.78,126.36 16.51,125.09 8.26,125.09 EDGE.BU2
BV2  (via drill 0.81)
  Top 0.406: v16.51,127 v78.74,127
  Bottom 0.406: v78.74,127 E14.1 | v16.51,127 15.24,128.27 8.26,128.27 EDGE.BV2
GND  (via drill 0.81)
  Top 0.508: E13.8 16.51,119.38 13.97,121.92 8.26,121.92 EDGE.BT1 | C13.2 v50.8,118.11 v80.01,118.11 86.36,118.11 87.63,119.38 E15.7 | v90.81,124.46 C14.2 v109.22,124.46 | E14.12 v20.32,123.19 | C11.2 v80.01,90.17 81.28,91.44 E12.7 | v88.9,93.98 v109.22,93.98 | C8.2 83.82,59.69 85.09,60.96 E9.7 | C9.2 106.68,59.69 105.41,58.42 v88.9,58.42 | C10.2 53.34,90.17 54.61,91.44 E11.7 | C7.2 52.71,59.69 53.98,60.96 E8.7 | v57.15,55.88 v63.5,55.88 v68.58,55.88 69.85,57.15 v76.2,57.15 | v76.2,87.63 73.03,87.63 71.76,86.36 v56.52,86.36 | C16.- v22.86,68.58 | v20.32,52.07 8.26,52.07 EDGE.AT1 | v15.88,80.64 16.51,80.64 17.15,81.28 v20.96,81.28 | C1.2 53.34,16.51 54.61,17.78 E2.7 | C2.2 86.36,16.51 87.63,17.78 E3.7 | v76.2,13.97 v55.88,13.97 | v20.32,17.78 E1.7 | C5.2 86.36,36.83 87.63,38.1 E6.7 | C4.2 53.34,36.83 54.61,38.1 E5.7 | v43.18,40.64 v22.86,40.64 | v55.88,40.64 v68.58,40.64 v76.2,40.64 | v107.95,34.92 107.32,34.29 v88.9,34.29 | E4.7 v20.32,38.1 | C17.- v16.51,5.08
  Bottom 0.508: v50.8,118.11 E14.12 | v90.81,124.46 90.17,123.83 90.17,121.28 88.9,120.02 E15.7 | v109.22,124.46 C15.2 | v20.32,123.19 E13.8 | v109.22,93.98 C12.2 | E12.7 v88.9,93.98 | E9.7 v88.9,58.42 | v63.5,55.88 E8.11 | v68.58,55.88 E8.13 v68.58,40.64 | v57.15,55.88 57.15,57.15 55.88,58.42 E8.7 55.88,61.59 57.15,62.87 57.15,84.45 55.88,85.72 55.88,86.36 | 55.88,86.36 E11.7 | v76.2,57.15 C8.2 | v76.2,87.63 C11.2 | 55.88,86.36 v56.52,86.36 | v22.86,68.58 E7.7 | E10.8 20.32,88.9 21.59,87.63 21.59,81.92 v20.96,81.28 20.96,73.03 20.32,72.39 C16.- v20.32,52.07 v20.32,38.1 20.32,31.75 20.96,31.11 20.96,29.84 20.32,29.21 v20.32,17.78 C17.- | v15.88,80.64 8.26,80.64 EDGE.BC2 | v55.88,13.97 E2.7 55.88,21.59 54.61,22.86 54.61,33.02 55.88,34.29 E5.7 v55.88,40.64 | C2.2 v76.2,13.97 | C3.2 109.22,26.67 107.95,27.94 107.95,34.29 | 107.95,34.29 109.22,35.56 C6.2 | v22.86,40.64 E4.7 | C4.2 v43.18,40.64 | v76.2,40.64 C5.2 | v107.95,34.92 107.95,34.29 | E6.7 v88.9,34.29 | v16.51,5.08 16.51,10.79 8.26,10.79 EDGE.AC2 | v80.01,90.17 v80.01,118.11
  pour Top (isolate 0.508): 15.24,0 15.24,132.08 125.73,132.08 125.73,0
  pour Bottom (isolate 0.508): 15.24,0 15.24,132.08 125.73,132.08 125.73,0
N$1  (via drill 0.81)
  Top 0.406: v97.79,27.3 v34.29,27.3
  Bottom 0.406: E3.4 97.79,17.78 | 97.79,17.78 E3.3 | E1.3 33.02,24.13 34.29,25.4 v34.29,27.3 | 97.79,17.78 v97.79,27.3
N$4  (via drill 0.81)
  Top 0.406: v53.34,20.32 v57.15,20.32 | v59.69,97.79 v92.08,97.79
  Bottom 0.406: E2.9 58.42,13.34 57.15,14.61 v57.15,20.32 | v53.34,20.32 53.34,61.59 54.61,62.87 54.61,92.08 57.79,95.25 59.69,95.25 v59.69,97.79 59.69,104.78 60.96,106.05 E14.17 | E15.9 91.44,107.95 92.08,107.31 v92.08,97.79
N$5  (via drill 0.81)
  Top 0.406: E6.13 100.33,31.75 87.63,31.75 86.36,30.48 73.03,30.48 71.76,31.75 v62.23,31.75 55.25,31.75 53.98,30.48 40.01,30.48 38.74,31.75 34.29,31.75 E4.12 | v33.02,26.04 v27.94,26.04
  Bottom 0.406: v27.94,26.04 E1.5 | v33.02,26.04 E4.12 33.02,32.38 35.56,34.92 E4.2 | E2.4 63.5,21.59 62.23,22.86 v62.23,31.75
N$6  (via drill 0.81)
  Top 0.406: v46.99,76.2 v33.66,76.2
  Bottom 0.406: E4.13 35.56,33.66 36.83,34.92 36.83,38.73 34.29,41.27 34.29,64.77 33.66,65.41 v33.66,76.2 | v46.99,76.2 46.99,116.2 43.82,119.38 41.91,119.38 39.37,116.84 33.02,116.84 E13.3
N$7
  Bottom 0.406: E1.4 29.21,19.05 29.21,61.59 30.48,62.87 30.48,81.92 29.21,83.19 29.21,114.3 30.48,115.57 E13.4
N$8
  Bottom 0.406: E13.12 27.94,114.3 29.21,115.57 29.21,120.02 29.85,120.65 31.75,120.65 31.75,114.94 34.29,112.39 34.29,98.42 40.64,92.08 40.64,45.72 38.1,43.18 E4.1
N$9
  Bottom 0.406: E4.4 31.75,39.37 31.75,110.49 E13.13
N$10
  Top 0.406: E9.12 100.33,54.61 106.05,54.61 110.49,59.05 110.49,106.68 81.92,106.68 79.38,109.22 57.15,109.22 E14.15
N$11  (via drill 0.81)
  Top 0.406: v90.17,54.61 93.35,54.61 94.62,55.88 v102.87,55.88
  Bottom 0.406: E3.6 91.44,21.59 90.17,22.86 v90.17,54.61 | v102.87,55.88 102.87,64.77 101.6,66.04 E12.13
N$12
  Bottom 0.406: E1.12 34.29,8.89 41.91,8.89 41.91,12.06 42.55,12.7 45.09,12.7 45.09,6.35 47.63,3.81 71.76,3.81 71.76,4.45 72.39,5.08 113.03,5.08 113.03,122.56 108.59,127 80.01,127 80.01,127.64 76.84,130.81 64.77,130.81 64.77,98.42 60.96,94.61 E11.5
N$13  (via drill 0.81)
  Top 0.406: E14.3 74.3,123.19 75.57,121.92 86.36,121.92 87.63,123.19 v92.08,123.19
  Bottom 0.406: v92.08,123.19 91.44,122.56 E15.6
N$14  (via drill 0.81)
  Top 0.406: E12.2 100.33,92.71 95.25,92.71 E12.5 | v92.71,114.3 v63.5,114.3
  Bottom 0.406: E9.3 E12.12 99.06,87 101.6,89.53 E12.2 | E12.9 91.44,87 93.98,89.53 E12.5 93.98,95.25 93.35,95.89 93.35,110.49 92.71,111.12 v92.71,114.3 | v63.5,114.3 E14.7
N$15
  Bottom 0.406: E9.11 97.79,52.07 105.41,52.07 105.41,90.17 E12.1
N$16  (via drill 0.81)
  Top 0.406: v92.71,55.88 v88.9,55.88
  Bottom 0.406: v88.9,55.88 E9.8 | v92.71,55.88 92.71,77.47 95.25,80.01 95.25,87 96.52,88.27 E12.4
N$17
  Bottom 0.406: E9.6 91.44,81.28 E12.10
N$18  (via drill 0.81)
  Top 0.406: v76.2,113.03 85.73,113.03 87,111.76 E15.8
  Bottom 0.406: v76.2,113.03 E14.2
N$19  (via drill 0.81)
  Top 0.406: v96.52,69.22 95.89,68.58 v53.34,68.58
  Bottom 0.406: v96.52,69.22 E12.11 | v53.34,68.58 53.34,87 52.07,88.27 52.07,92.08 54.61,94.61 54.61,109.86 55.88,111.12 55.88,114.94 57.15,116.2 57.15,123.83 59.06,125.73 60.96,125.73 E14.8
N$20
  Top 0.406: E14.5 69.85,121.92 71.76,121.92 72.39,122.56 72.39,125.73 109.86,125.73 110.49,125.09 110.49,120.65 100.33,120.65 E15.3
N$21
  Top 0.406: E14.4 69.85,124.46 19.69,124.46 19.05,123.83 19.05,120.65 33.66,120.65 34.29,120.02 34.29,110.49 66.68,110.49 67.95,111.76 85.73,111.76 87,110.49 92.08,110.49 92.71,111.12 92.71,113.03 95.25,113.03 E15.11
N$22
  Bottom 0.406: E12.8 87.63,85.09 87.63,113.67 79.38,121.92 77.47,121.92 77.47,127.64 75.57,129.54 66.04,129.54 E14.6
N$23  (via drill 0.81)
  Top 0.406: v53.34,88.9 62.87,88.9 64.14,90.17 71.76,90.17 74.3,92.71 89.54,92.71 90.81,91.44 E12.6
  Bottom 0.406: E14.9 58.42,116.2 57.15,114.94 57.15,95.89 53.34,92.08 v53.34,88.9
N$24  (via drill 0.81)
  Top 0.406: v52.07,100.33 v100.33,100.33
  Bottom 0.406: E14.10 E14.11 53.34,121.28 52.07,120.02 v52.07,100.33 | E12.3 99.06,95.25 100.33,96.52 v100.33,100.33
N$25  (via drill 0.81)
  Top 0.406: v30.48,88.27 v26.67,88.27
  Bottom 0.406: E7.9 25.4,56.52 26.67,57.78 26.67,61.59 27.94,62.87 27.94,81.28 26.67,82.55 v26.67,88.27 | E10.4 v30.48,88.27
N$26
  Bottom 0.406: E7.13 38.1,55.88 38.1,59.05 39.37,60.33 39.37,92.08 36.2,95.25 33.02,95.25 E10.3
N$27
  Top 0.406: E7.4 E7.5
  Bottom 0.406: E10.12 27.94,82.55 29.21,81.28 29.21,62.87 27.94,61.59 E7.5
N$28  (via drill 0.81)
  Top 0.406: v34.29,86.36 v30.48,86.36
  Bottom 0.406: E7.1 E7.2 35.56,64.77 34.93,65.41 34.93,82.55 34.29,83.19 v34.29,86.36 | v30.48,86.36 E10.13
N$33
  Top 0.406: E2.10 62.23,8.89 90.17,8.89 E3.9
N$43
  Bottom 0.406: E5.4 62.23,39.37 62.23,59.69 E8.5
N$44
  Top 0.406: E5.3 68.58,35.56 103.51,35.56 106.68,38.73 106.68,52.07 55.25,52.07 54.61,52.7 54.61,57.15 61.6,57.15 64.77,60.33 64.77,62.23 59.69,62.23 E8.6
N$45  (via drill 0.81)
  Top 0.406: E1.13 34.29,11.43 29.21,11.43 E1.10 | v39.37,35.56 v58.42,35.56
  Bottom 0.406: v58.42,35.56 E5.6 | v39.37,35.56 39.37,24.13 36.83,21.59 36.83,14.61 35.56,13.34 E1.13
N$46  (via drill 0.81)
  Top 0.406: v58.42,23.5 v26.67,23.5
  Bottom 0.406: E1.9 25.4,15.88 26.67,17.14 v26.67,23.5 | E2.6 v58.42,23.5
VCC  (via drill 0.81)
  Top 0.508: C2.1 73.03,11.43 71.76,12.7 v71.12,12.7 48.26,12.7 46.99,11.43 C1.1 41.28,11.43 40.01,10.16 E1.14 | v17.15,1.27 19.69,1.27 20.32,0.64 41.91,0.64 42.55,1.27 v43.18,1.27 | E9.14 106.05,53.34 107.32,54.61 C9.1 | E3.14 106.05,10.16 107.32,11.43 C3.1 | E6.14 106.05,30.48 107.32,31.75 C6.1 | E8.14 73.03,53.34 74.3,54.61 C8.1 | v38.1,33.02 38.74,33.02 40.01,31.75 C4.1 v50.8,31.75 53.98,31.75 55.25,33.02 v71.12,33.02 71.76,33.02 73.03,31.75 C5.1 86.36,31.75 87.63,33.02 v104.14,33.02 | E10.16 38.74,83.82 40.01,85.09 C10.1 53.34,85.09 55.88,87.63 v71.12,87.63 | E7.14 40.01,53.34 41.28,54.61 C7.1 v50.8,54.61 | v43.18,74.93 v15.88,74.93 | E12.14 106.05,83.82 107.32,85.09 C12.1 | E15.14 106.05,111.76 107.32,113.03 C15.1 | E13.16 40.01,111.76 41.28,113.03 C13.1 | E11.14 73.03,83.82 74.3,85.09 C11.1 v78.74,85.09 | v88.9,121.92 87.63,121.92 86.36,120.65 v78.74,120.65 | v43.18,115.57 v78.74,115.57 v104.14,115.57
  Bottom 0.508: E2.14 v71.12,12.7 69.85,13.97 69.85,25.4 71.12,26.67 E5.14 v71.12,33.02 71.12,36.2 69.85,37.47 69.85,48.26 71.12,49.53 E8.14 | C1.1 C17.+ v43.18,1.27 | v17.15,1.27 16.51,1.91 16.51,3.81 12.07,3.81 11.43,4.45 8.26,4.45 EDGE.AA2 | C3.1 109.22,14.61 110.49,15.88 110.49,26.67 109.22,27.94 C6.1 109.22,34.29 110.49,35.56 110.49,38.73 109.22,40.01 C9.1 | v38.1,33.02 E4.14 | v104.14,33.02 E6.14 | C7.1 43.18,57.15 41.91,58.42 41.91,65.41 43.18,66.67 C16.+ v43.18,74.93 C10.1 | v15.88,74.93 15.88,73.66 12.07,73.66 11.43,74.3 8.26,74.3 EDGE.BA2 | C12.1 109.22,88.27 107.95,89.53 107.95,101.6 109.22,102.87 C15.1 | v78.74,85.09 E14.24 v78.74,115.57 v78.74,120.65 | v88.9,121.92 C14.1 | v43.18,115.57 C13.1 | v104.14,115.57 E15.14 | E11.14 v71.12,87.63 | v50.8,54.61 v50.8,31.75

### Text on the board
Bottom: VRS | TU10 CRC AND WRITE GATING